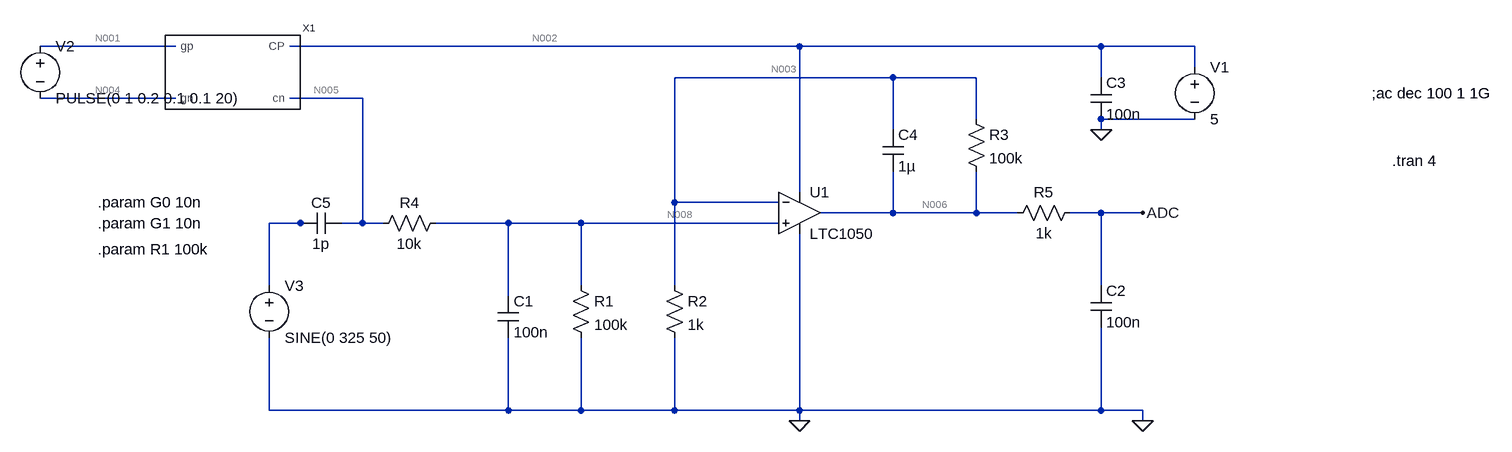
[diagram p0: schematic amplificateur_capteurGaz.asc]
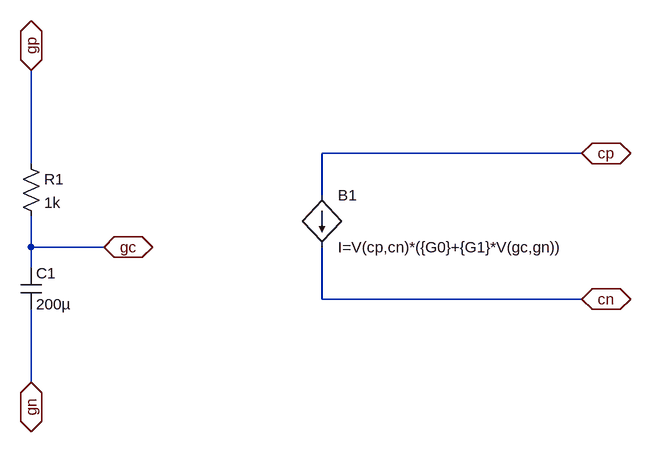
[diagram p1: sub-circuit new_symbol.asc]
amplificateur_capteurGaz.asc, the LTspice schematic file:
Version 4
SHEET 1 1508 680
WIRE -528 -224 -736 -224
WIRE 432 -224 -352 -224
WIRE 896 -224 432 -224
WIRE 1040 -224 896 -224
WIRE 1040 -192 1040 -224
WIRE 576 -176 240 -176
WIRE 704 -176 576 -176
WIRE 896 -176 896 -224
WIRE -528 -144 -736 -144
WIRE -240 -144 -352 -144
WIRE 704 -112 704 -176
WIRE 1040 -112 896 -112
WIRE 576 -96 576 -176
WIRE 896 -96 896 -112
WIRE 432 0 432 -224
WIRE 240 16 240 -176
WIRE 400 16 240 16
WIRE 576 32 576 -32
WIRE 576 32 464 32
WIRE 704 32 704 -32
WIRE 704 32 576 32
WIRE 768 32 704 32
WIRE 896 32 848 32
WIRE 960 32 896 32
WIRE -336 48 -384 48
WIRE -320 48 -336 48
WIRE -240 48 -240 -144
WIRE -240 48 -272 48
WIRE -208 48 -240 48
WIRE -16 48 -128 48
WIRE 96 48 -16 48
WIRE 400 48 96 48
WIRE -384 144 -384 48
WIRE 96 144 96 48
WIRE 240 144 240 16
WIRE 896 144 896 32
WIRE -16 160 -16 48
WIRE -384 336 -384 224
WIRE -16 336 -16 224
WIRE -16 336 -384 336
WIRE 96 336 96 224
WIRE 96 336 -16 336
WIRE 240 336 240 224
WIRE 240 336 96 336
WIRE 432 336 432 64
WIRE 432 336 240 336
WIRE 896 336 896 208
WIRE 896 336 432 336
WIRE 960 336 896 336
WIRE 432 352 432 336
WIRE 960 352 960 336
FLAG 432 352 0
FLAG 960 352 0
FLAG 896 -96 0
FLAG 960 32 ADC
SYMBOL res 80 128 R0
SYMATTR InstName R1
SYMATTR Value 100k
SYMBOL res 224 128 R0
SYMATTR InstName R2
SYMATTR Value 1k
SYMBOL res 688 -128 R0
SYMATTR InstName R3
SYMATTR Value 100k
SYMBOL res -112 32 R90
WINDOW 0 0 56 VBottom 2
WINDOW 3 32 56 VTop 2
SYMATTR InstName R4
SYMATTR Value 10k
SYMBOL cap -32 160 R0
SYMATTR InstName C1
SYMATTR Value 100n
SYMBOL cap 880 144 R0
SYMATTR InstName C2
SYMATTR Value 100n
SYMBOL cap 560 -96 R0
SYMATTR InstName C4
SYMATTR Value 1µ
SYMBOL OpAmps\\LTC1050 432 -32 R0
SYMATTR InstName U1
SYMBOL res 864 16 R90
WINDOW 0 0 56 VBottom 2
WINDOW 3 32 56 VTop 2
SYMATTR InstName R5
SYMATTR Value 1k
SYMBOL cap 880 -176 R0
SYMATTR InstName C3
SYMATTR Value 100n
SYMBOL voltage 1040 -208 R0
WINDOW 123 0 0 Left 0
WINDOW 39 0 0 Left 0
SYMATTR InstName V1
SYMATTR Value 5
SYMBOL New_Symbol -448 -192 R0
SYMATTR InstName X1
SYMBOL voltage -736 -240 R0
WINDOW 123 0 0 Left 0
WINDOW 39 0 0 Left 0
SYMATTR InstName V2
SYMATTR Value PULSE(0 1 0.2 0.1 0.1 20)
SYMBOL cap -272 32 R90
WINDOW 0 0 32 VBottom 2
WINDOW 3 32 32 VTop 2
SYMATTR InstName C5
SYMATTR Value 1p
SYMBOL voltage -384 128 R0
WINDOW 123 0 0 Left 0
WINDOW 39 0 0 Left 0
SYMATTR InstName V3
SYMATTR Value SINE(0 325 50)
TEXT 1344 -48 Left 2 !.tran 4
TEXT 1312 -152 Left 2 !;ac dec 100 1 1G
TEXT -648 16 Left 2 !.param G0 10n
TEXT -648 48 Left 2 !.param G1 10n
TEXT -648 88 Left 2 !.param R1 100k

new_symbol.asc, the sub-circuit schematic file:
Version 4
SHEET 1 880 680
WIRE 464 64 64 64
WIRE -384 80 -384 -64
WIRE 64 128 64 64
WIRE -384 208 -384 160
WIRE -272 208 -384 208
WIRE -384 240 -384 208
WIRE 64 288 64 208
WIRE 464 288 64 288
WIRE -384 416 -384 304
FLAG 464 64 cp
IOPIN 464 64 BiDir
FLAG 464 288 cn
IOPIN 464 288 BiDir
FLAG -384 -64 gp
IOPIN -384 -64 BiDir
FLAG -272 208 gc
IOPIN -272 208 BiDir
FLAG -384 416 gn
IOPIN -384 416 BiDir
SYMBOL bi 64 128 R0
SYMATTR InstName B1
SYMATTR Value I=V(cp,cn)*({G0}+{G1}*V(gc,gn))
SYMBOL res -400 64 R0
SYMATTR InstName R1
SYMATTR Value 1k
SYMBOL cap -400 240 R0
SYMATTR InstName C1
SYMATTR Value 200µ

The netlist it stands for:
* amplificateur_capteurGaz.asc
R1 N008 0 100k
R2 N003 0 1k
R3 N003 N006 100k
R4 N008 N005 10k
C1 N008 0 100n
C2 ADC 0 100n
C4 N003 N006 1µ
XU1 N008 N003 N002 0 N006 LTC1050  ; pins In+ In- V+ V- OUT
R5 ADC N006 1k
C3 N002 0 100n
V1 N002 0 5
XX1 N002 N005 N001 N004 new_symbol
V2 N001 N004 PULSE(0 1 0.2 0.1 0.1 20)
C5 N005 N007 1p
V3 N007 0 SINE(0 325 50)

* block symbol definitions
.subckt new_symbol CP cn gp gn
B1 cp cn I=V(cp,cn)*({G0}+{G1}*V(gc,gn))
R1 gp gc 1k
C1 gc gn 200µ
.ends new_symbol

.tran 4
;ac dec 100 1 1G
.param G0 10n
.param G1 10n
.param R1 100k
.lib LTC.lib
.backanno
.end

* Results of the author's LTspice run, read from the files saved beside the schematic
* Operating Point, zero values left out:
*   V(n008) = 4.995 mV
*   V(n003) = 4.995 mV
*   V(n006) = 504.4 mV
*   V(n005) = 5.494 mV
*   V(adc) = 504.4 mV
*   V(n002) = 5 V
*   I(R4) = -49.95 nA
*   I(R3) = -4.995 µA
*   I(R2) = 4.995 µA
*   I(R1) = 49.95 nA
*   I(V1) = -754.2 µA
*   Ix(u1:3) = 754.1 µA
*   Ix(u1:4) = -749.1 µA
*   Ix(u1:5) = -4.995 µA
*   Ix(x1:CP) = 49.95 nA
*   Ix(x1:CN) = -49.95 nA
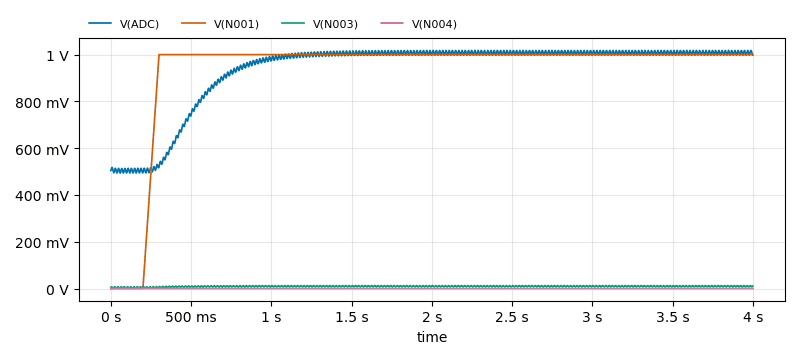
[diagram p2: Transient Analysis of amplificateur_capteurGaz.asc, plotted from the saved traces]
* Transient Analysis, 1 run:
*   V(ADC): min 493.8 mV, max 1.018 V, average 937.4 mV, rms 949.6 mV, last 999.3 mV
*   V(N001): min 0 V, max 1 V, average 937.5 mV, rms 966.1 mV, last 1 V
*   V(N003): min 1.679 mV, max 13.07 mV, average 9.403 mV, rms 9.747 mV, last 10.91 mV
*   V(N004): min -888.1 µV, max 444.5 µV, average 471 nV, rms 38.53 µV, last 222.1 µV